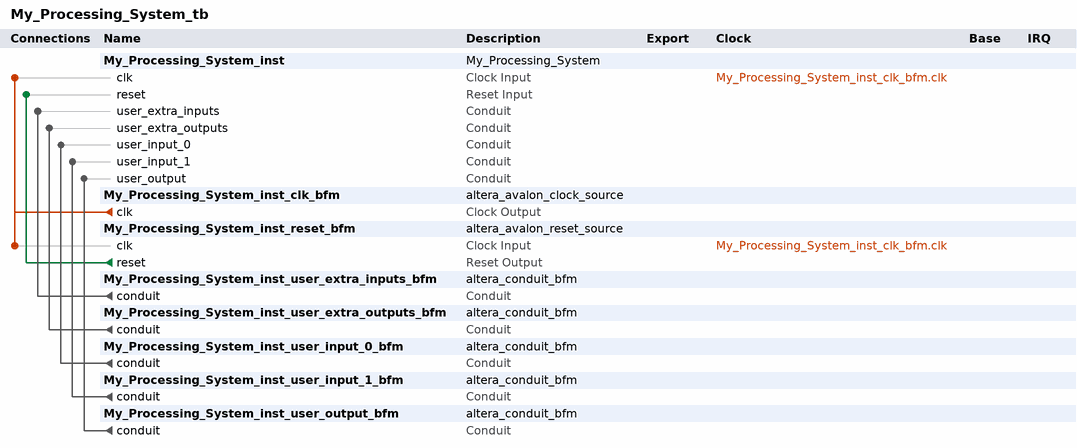
[diagram p0: system contents]
# Platform Designer (Qsys) system My_Processing_System_tb, Cyclone IV E EP4CE22F17C6
# Parameters at their usual value, and those the tool derives, are not listed.
package require -exact qsys 17.1
create_system My_Processing_System_tb
set_project_property DEVICE_FAMILY {Cyclone IV E}
set_project_property DEVICE EP4CE22F17C6

add_instance My_Processing_System_inst My_Processing_System 1.0

add_instance My_Processing_System_inst_clk_bfm altera_avalon_clock_source 17.1

add_instance My_Processing_System_inst_reset_bfm altera_avalon_reset_source 17.1
set_instance_parameter_value My_Processing_System_inst_reset_bfm ASSERT_HIGH_RESET 0
set_instance_parameter_value My_Processing_System_inst_reset_bfm INITIAL_RESET_CYCLES 50

add_instance My_Processing_System_inst_user_extra_inputs_bfm altera_conduit_bfm 17.1
set_instance_parameter_value My_Processing_System_inst_user_extra_inputs_bfm CLOCKED_SIGNAL false
set_instance_parameter_value My_Processing_System_inst_user_extra_inputs_bfm ENABLE_RESET false
set_instance_parameter_value My_Processing_System_inst_user_extra_inputs_bfm SIGNAL_DIRECTIONS input
set_instance_parameter_value My_Processing_System_inst_user_extra_inputs_bfm SIGNAL_WIDTHS 4

add_instance My_Processing_System_inst_user_extra_outputs_bfm altera_conduit_bfm 17.1
set_instance_parameter_value My_Processing_System_inst_user_extra_outputs_bfm CLOCKED_SIGNAL false
set_instance_parameter_value My_Processing_System_inst_user_extra_outputs_bfm ENABLE_RESET false
set_instance_parameter_value My_Processing_System_inst_user_extra_outputs_bfm SIGNAL_DIRECTIONS output
set_instance_parameter_value My_Processing_System_inst_user_extra_outputs_bfm SIGNAL_WIDTHS 4

add_instance My_Processing_System_inst_user_input_0_bfm altera_conduit_bfm 17.1
set_instance_parameter_value My_Processing_System_inst_user_input_0_bfm CLOCKED_SIGNAL false
set_instance_parameter_value My_Processing_System_inst_user_input_0_bfm ENABLE_RESET false
set_instance_parameter_value My_Processing_System_inst_user_input_0_bfm SIGNAL_DIRECTIONS input
set_instance_parameter_value My_Processing_System_inst_user_input_0_bfm SIGNAL_WIDTHS 32

add_instance My_Processing_System_inst_user_input_1_bfm altera_conduit_bfm 17.1
set_instance_parameter_value My_Processing_System_inst_user_input_1_bfm CLOCKED_SIGNAL false
set_instance_parameter_value My_Processing_System_inst_user_input_1_bfm ENABLE_RESET false
set_instance_parameter_value My_Processing_System_inst_user_input_1_bfm SIGNAL_DIRECTIONS input
set_instance_parameter_value My_Processing_System_inst_user_input_1_bfm SIGNAL_WIDTHS 32

add_instance My_Processing_System_inst_user_output_bfm altera_conduit_bfm 17.1
set_instance_parameter_value My_Processing_System_inst_user_output_bfm CLOCKED_SIGNAL false
set_instance_parameter_value My_Processing_System_inst_user_output_bfm ENABLE_RESET false
set_instance_parameter_value My_Processing_System_inst_user_output_bfm SIGNAL_DIRECTIONS output
set_instance_parameter_value My_Processing_System_inst_user_output_bfm SIGNAL_WIDTHS 32

# connections
add_connection My_Processing_System_inst_clk_bfm.clk My_Processing_System_inst.clk clock
add_connection My_Processing_System_inst_clk_bfm.clk My_Processing_System_inst_reset_bfm.clk clock
add_connection My_Processing_System_inst_reset_bfm.reset My_Processing_System_inst.reset reset
add_connection My_Processing_System_inst_user_extra_inputs_bfm.conduit My_Processing_System_inst.user_extra_inputs conduit
add_connection My_Processing_System_inst_user_extra_outputs_bfm.conduit My_Processing_System_inst.user_extra_outputs conduit
add_connection My_Processing_System_inst_user_input_0_bfm.conduit My_Processing_System_inst.user_input_0 conduit
add_connection My_Processing_System_inst_user_input_1_bfm.conduit My_Processing_System_inst.user_input_1 conduit
add_connection My_Processing_System_inst_user_output_bfm.conduit My_Processing_System_inst.user_output conduit

set_interconnect_requirement {$system} qsys_mm.clockCrossingAdapter HANDSHAKE
set_interconnect_requirement {$system} qsys_mm.enableEccProtection FALSE
set_interconnect_requirement {$system} qsys_mm.insertDefaultSlave FALSE
set_interconnect_requirement {$system} qsys_mm.maxAdditionalLatency 1

save_system My_Processing_System_tb.qsys
